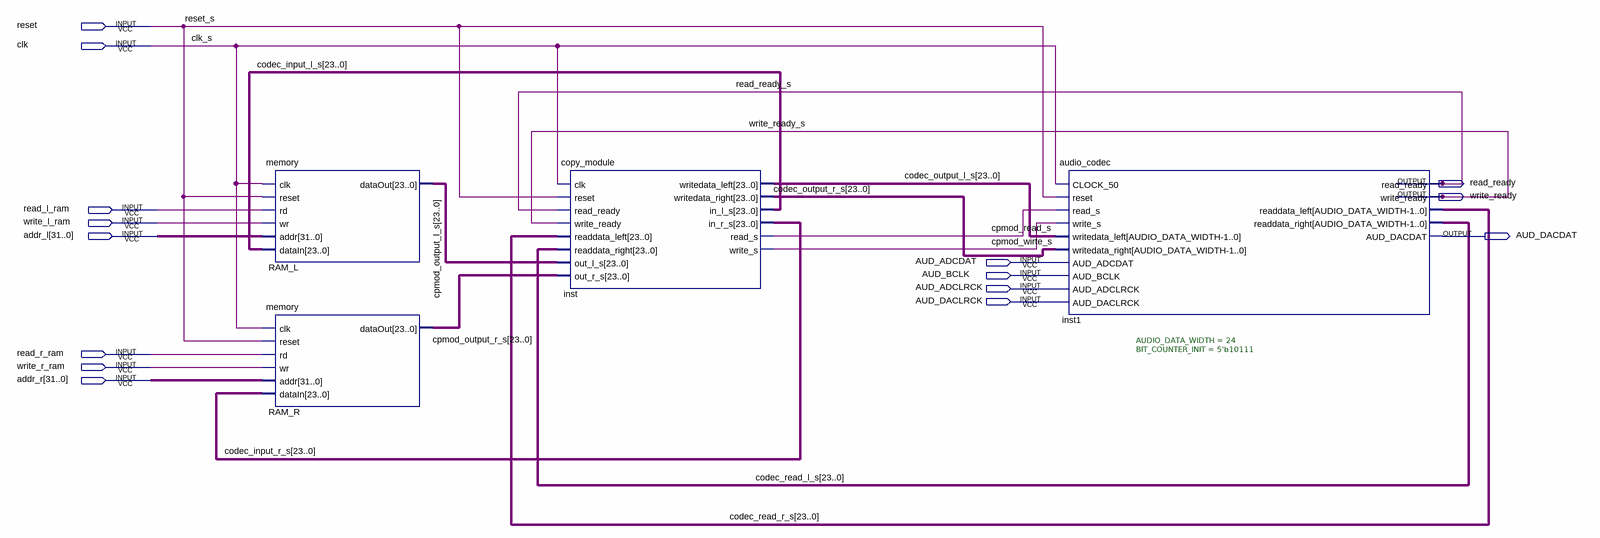
[diagram p0: schematic sheet]
// Quartus schematic Meilenstei1Hardware.bdf as structural Verilog: 4 symbols, 15 pins
module Meilenstei1Hardware (
  input  reset,
  input  clk,
  input  read_l_ram,
  input  write_l_ram,
  input  [31:0] addr_l,
  input  AUD_ADCDAT,
  input  AUD_BCLK,
  input  AUD_ADCLRCK,
  input  AUD_DACLRCK,
  input  read_r_ram,
  input  write_r_ram,
  input  [31:0] addr_r,
  output read_ready,
  output write_ready,
  output AUD_DACDAT
);

  wire cpmod_read_s, cpmod_wirte_s;
  wire [23:0] codec_input_l_s, codec_input_r_s, codec_output_l_s, codec_output_r_s, codec_read_l_s,
       codec_read_r_s, cpmod_output_l_s, cpmod_output_r_s;

  memory RAM_L (
    .clk(clk), .reset(reset), .rd(read_l_ram), .wr(write_l_ram), .addr(addr_l), .dataIn(codec_input_l_s),
    .dataOut(cpmod_output_l_s));
  memory RAM_R (
    .clk(clk), .reset(reset), .rd(read_r_ram), .wr(write_r_ram), .addr(addr_r), .dataIn(codec_input_r_s),
    .dataOut(cpmod_output_r_s));
  copy_module inst (
    .clk(clk), .reset(reset), .read_ready(read_ready), .write_ready(write_ready),
    .readdata_left(codec_read_r_s), .readdata_right(codec_read_l_s), .out_l_s(cpmod_output_l_s),
    .out_r_s(cpmod_output_r_s), .writedata_left(codec_output_l_s), .writedata_right(codec_output_r_s),
    .in_l_s(codec_input_l_s), .in_r_s(codec_input_r_s), .read_s(cpmod_read_s), .write_s(cpmod_wirte_s));
  audio_codec #(.AUDIO_DATA_WIDTH(24), .BIT_COUNTER_INIT(5'b10111)) inst1 (
    .CLOCK_50(clk), .reset(reset), .read_s(cpmod_read_s), .write_s(cpmod_wirte_s),
    .writedata_left(codec_output_l_s), .writedata_right(codec_output_r_s), .AUD_ADCDAT(AUD_ADCDAT),
    .AUD_BCLK(AUD_BCLK), .AUD_ADCLRCK(AUD_ADCLRCK), .AUD_DACLRCK(AUD_DACLRCK), .read_ready(read_ready),
    .write_ready(write_ready), .readdata_left(codec_read_r_s), .readdata_right(codec_read_l_s),
    .AUD_DACDAT(AUD_DACDAT));

  // Other names for the same wires on the sheet: clk_s = clk; read_ready_s = read_ready; reset_s = reset;
  //   write_ready_s = write_ready
endmodule
